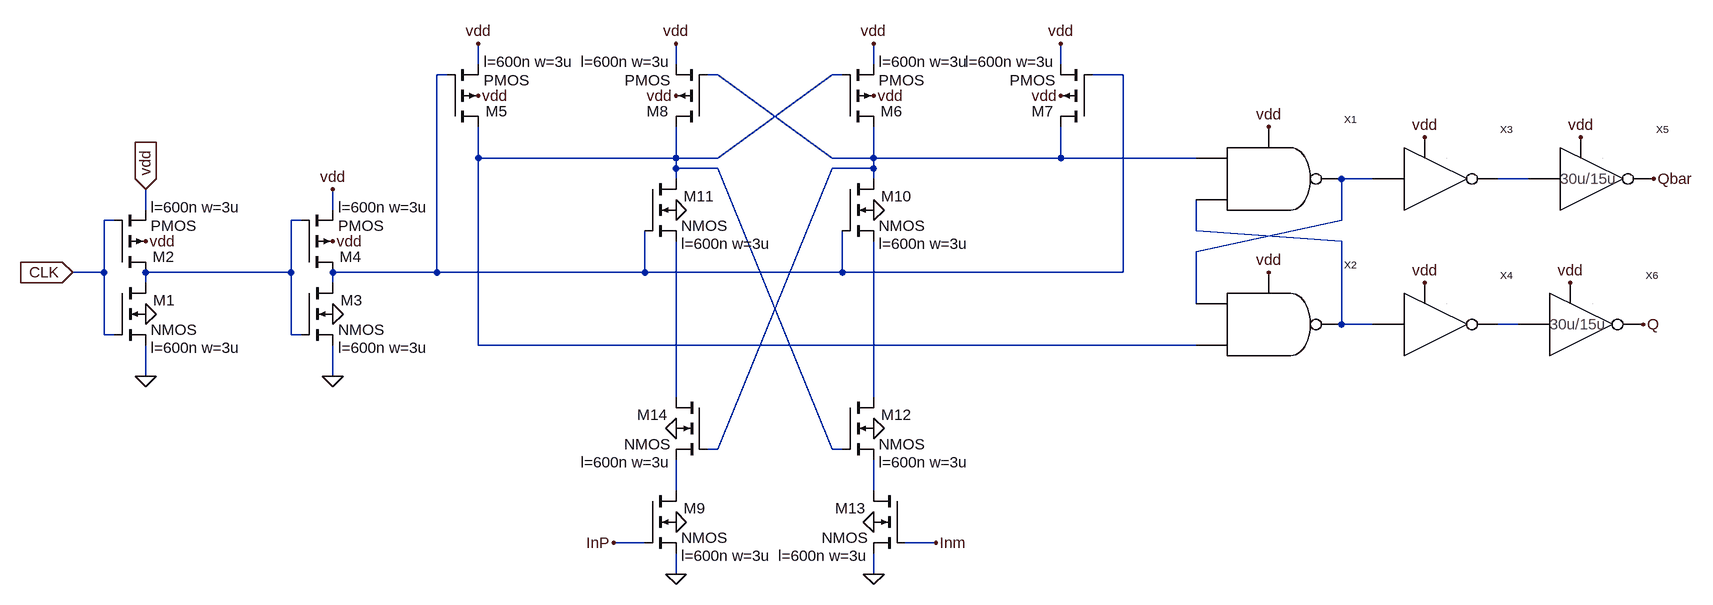
[diagram p0: schematic clk_comparator.asc]
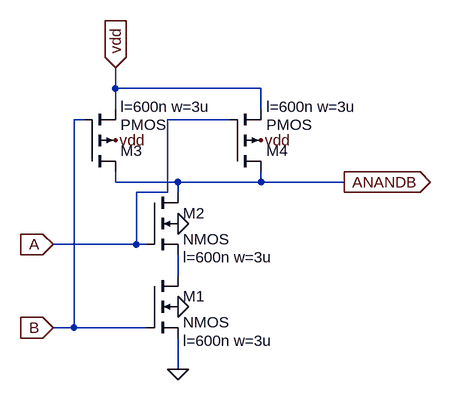
[diagram p1: sub-circuit nand_2.asc]
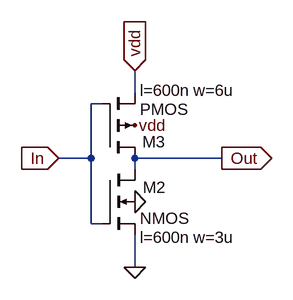
[diagram p2: sub-circuit inv_6u_3u.asc]
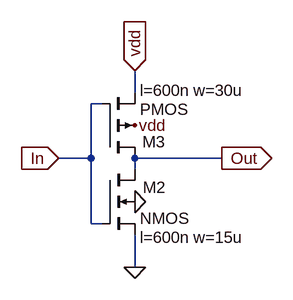
[diagram p3: sub-circuit inv_30u_15u.asc]
clk_comparator.asc, the LTspice schematic file:
Version 4
SHEET 1 2480 680
WIRE 592 -416 592 -448
WIRE 896 -416 896 -448
WIRE 1200 -416 1200 -448
WIRE 1488 -416 1488 -448
WIRE 544 -400 528 -400
WIRE 960 -400 944 -400
WIRE 1152 -400 1136 -400
WIRE 1584 -400 1536 -400
WIRE 592 -272 592 -320
WIRE 896 -272 896 -320
WIRE 896 -272 592 -272
WIRE 960 -272 1136 -400
WIRE 960 -272 896 -272
WIRE 1136 -272 960 -400
WIRE 1200 -272 1200 -320
WIRE 1200 -272 1136 -272
WIRE 1488 -272 1488 -320
WIRE 1488 -272 1200 -272
WIRE 1696 -272 1488 -272
WIRE 896 -256 896 -272
WIRE 960 -256 896 -256
WIRE 1200 -256 1200 -272
WIRE 1200 -256 1136 -256
WIRE 896 -240 896 -256
WIRE 1200 -240 1200 -256
WIRE 1968 -240 1920 -240
WIRE 2208 -240 2160 -240
WIRE 80 -192 80 -224
WIRE 368 -192 368 -224
WIRE 32 -176 16 -176
WIRE 320 -176 304 -176
WIRE 1920 -176 1920 -240
WIRE 1696 -160 1696 -208
WIRE 1920 -144 1696 -160
WIRE 1696 -128 1920 -176
WIRE 16 -96 16 -176
WIRE 16 -96 -32 -96
WIRE 304 -96 304 -176
WIRE 304 -96 80 -96
WIRE 528 -96 528 -400
WIRE 528 -96 368 -96
WIRE 848 -96 848 -160
WIRE 848 -96 528 -96
WIRE 1152 -96 1152 -160
WIRE 1152 -96 848 -96
WIRE 1584 -96 1584 -400
WIRE 1584 -96 1152 -96
WIRE 80 -80 80 -96
WIRE 368 -80 368 -96
WIRE 1696 -48 1696 -128
WIRE 1920 -16 1920 -144
WIRE 1968 -16 1920 -16
WIRE 2192 -16 2160 -16
WIRE 16 0 16 -96
WIRE 32 0 16 0
WIRE 304 0 304 -96
WIRE 320 0 304 0
WIRE 592 16 592 -272
WIRE 1696 16 592 16
WIRE 80 64 80 16
WIRE 368 64 368 16
WIRE 896 96 896 -144
WIRE 1200 96 1200 -144
WIRE 960 176 1136 -256
WIRE 960 176 944 176
WIRE 1136 176 960 -256
WIRE 1152 176 1136 176
WIRE 896 240 896 192
WIRE 1200 240 1200 192
WIRE 848 320 800 320
WIRE 1296 320 1248 320
WIRE 896 368 896 336
WIRE 1200 368 1200 336
FLAG 80 64 0
FLAG 80 -32 0
FLAG -32 -96 CLK
IOPIN -32 -96 In
FLAG 80 -224 vdd
IOPIN 80 -224 In
FLAG 80 -144 vdd
FLAG 368 64 0
FLAG 368 -32 0
FLAG 368 -224 vdd
FLAG 368 -144 vdd
FLAG 592 -448 vdd
FLAG 592 -368 vdd
FLAG 1200 -448 vdd
FLAG 1200 -368 vdd
FLAG 1488 -448 vdd
FLAG 1488 -368 vdd
FLAG 896 -448 vdd
FLAG 896 -368 vdd
FLAG 896 288 0
FLAG 1200 -192 0
FLAG 896 -192 0
FLAG 1200 144 0
FLAG 896 368 0
FLAG 800 320 InP
FLAG 1200 288 0
FLAG 1200 368 0
FLAG 1296 320 Inm
FLAG 896 144 0
FLAG 1808 -320 vdd
FLAG 1808 -96 vdd
FLAG 2048 -304 vdd
FLAG 2048 -80 vdd
FLAG 2272 -80 vdd
FLAG 2288 -304 vdd
FLAG 2400 -240 Qbar
FLAG 2384 -16 Q
SYMBOL nmos4 32 -80 R0
WINDOW 123 56 100 Left 2
WINDOW 0 60 27 Left 2
SYMATTR Value2 l=600n w=3u
SYMATTR InstName M1
SYMBOL pmos4 32 -96 M180
WINDOW 123 56 100 Left 2
WINDOW 0 59 24 Left 2
SYMATTR Value2 l=600n w=3u
SYMATTR InstName M2
SYMBOL nmos4 320 -80 R0
WINDOW 123 56 100 Left 2
WINDOW 0 60 27 Left 2
SYMATTR Value2 l=600n w=3u
SYMATTR InstName M3
SYMBOL pmos4 320 -96 M180
WINDOW 123 56 100 Left 2
WINDOW 0 59 24 Left 2
SYMATTR Value2 l=600n w=3u
SYMATTR InstName M4
SYMBOL pmos4 544 -320 M180
WINDOW 123 56 100 Left 2
WINDOW 0 59 24 Left 2
SYMATTR Value2 l=600n w=3u
SYMATTR InstName M5
SYMBOL pmos4 1152 -320 M180
WINDOW 123 56 100 Left 2
WINDOW 0 59 24 Left 2
SYMATTR Value2 l=600n w=3u
SYMATTR InstName M6
SYMBOL pmos4 1536 -320 R180
WINDOW 123 56 100 Left 2
WINDOW 0 59 24 Left 2
SYMATTR Value2 l=600n w=3u
SYMATTR InstName M7
SYMBOL pmos4 944 -320 R180
WINDOW 123 56 100 Left 2
WINDOW 0 59 24 Left 2
SYMATTR Value2 l=600n w=3u
SYMATTR InstName M8
SYMBOL nmos4 848 240 R0
WINDOW 123 56 100 Left 2
WINDOW 0 60 27 Left 2
SYMATTR Value2 l=600n w=3u
SYMATTR InstName M9
SYMBOL nmos4 1152 -240 R0
WINDOW 123 56 100 Left 2
WINDOW 0 60 27 Left 2
SYMATTR Value2 l=600n w=3u
SYMATTR InstName M10
SYMBOL nmos4 848 -240 R0
WINDOW 123 56 100 Left 2
WINDOW 0 60 27 Left 2
SYMATTR Value2 l=600n w=3u
SYMATTR InstName M11
SYMBOL nmos4 1152 96 R0
WINDOW 123 56 100 Left 2
WINDOW 0 60 27 Left 2
SYMATTR Value2 l=600n w=3u
SYMATTR InstName M12
SYMBOL nmos4 1248 240 M0
WINDOW 123 56 100 Left 2
WINDOW 0 60 27 Left 2
SYMATTR Value2 l=600n w=3u
SYMATTR InstName M13
SYMBOL nmos4 944 96 M0
WINDOW 123 56 100 Left 2
WINDOW 0 60 27 Left 2
SYMATTR Value2 l=600n w=3u
SYMATTR InstName M14
SYMBOL NAND_2 1728 -240 R0
SYMATTR InstName X1
SYMBOL NAND_2 1728 -16 R0
SYMATTR InstName X2
SYMBOL Inv_6u_3u 1968 -240 R0
SYMATTR InstName X3
SYMBOL Inv_6u_3u 1968 -16 R0
SYMATTR InstName X4
SYMBOL Inv_30u_15u 2208 -240 R0
SYMATTR InstName X5
SYMBOL Inv_30u_15u 2192 -16 R0
SYMATTR InstName X6

nand_2.asc, the sub-circuit schematic file:
Version 4
SHEET 1 880 680
WIRE 176 -96 176 -128
WIRE 400 -96 176 -96
WIRE 176 -64 176 -96
WIRE 400 -64 400 -96
WIRE 128 -48 112 -48
WIRE 352 -48 256 -48
WIRE 176 48 176 32
WIRE 272 48 176 48
WIRE 400 48 400 32
WIRE 400 48 272 48
WIRE 528 48 400 48
WIRE 256 64 256 -48
WIRE 256 64 208 64
WIRE 272 64 272 48
WIRE 208 144 208 64
WIRE 208 144 80 144
WIRE 224 144 208 144
WIRE 272 192 272 160
WIRE 112 272 112 -48
WIRE 112 272 80 272
WIRE 224 272 112 272
WIRE 272 336 272 288
FLAG 272 336 0
FLAG 272 240 0
FLAG 272 112 0
FLAG 80 144 A
IOPIN 80 144 In
FLAG 80 272 B
IOPIN 80 272 In
FLAG 176 -128 vdd
IOPIN 176 -128 In
FLAG 176 -16 vdd
FLAG 400 -16 vdd
FLAG 528 48 ANANDB
IOPIN 528 48 Out
SYMBOL nmos4 224 192 R0
WINDOW 123 56 100 Left 2
SYMATTR InstName M1
SYMATTR Value2 l=600n w=3u
SYMBOL nmos4 224 64 R0
WINDOW 123 56 100 Left 2
SYMATTR InstName M2
SYMATTR Value2 l=600n w=3u
SYMBOL pmos4 128 32 M180
WINDOW 123 56 100 Left 2
SYMATTR InstName M3
SYMATTR Value2 l=600n w=3u
SYMBOL pmos4 352 32 M180
WINDOW 123 56 100 Left 2
SYMATTR InstName M4
SYMATTR Value2 l=600n w=3u

inv_6u_3u.asc, the sub-circuit schematic file:
Version 4
SHEET 1 880 680
WIRE 272 -48 272 -80
WIRE 224 -32 208 -32
WIRE 208 48 208 -32
WIRE 208 48 160 48
WIRE 400 48 272 48
WIRE 272 64 272 48
WIRE 208 144 208 48
WIRE 224 144 208 144
WIRE 272 208 272 160
FLAG 272 208 0
FLAG 272 112 0
FLAG 160 48 In
IOPIN 160 48 In
FLAG 272 -80 vdd
IOPIN 272 -80 In
FLAG 272 0 vdd
FLAG 400 48 Out
IOPIN 400 48 Out
SYMBOL nmos4 224 64 R0
WINDOW 123 56 100 Left 2
WINDOW 0 60 27 Left 2
SYMATTR Value2 l=600n w=3u
SYMATTR InstName M2
SYMBOL pmos4 224 48 M180
WINDOW 123 56 100 Left 2
WINDOW 0 59 24 Left 2
SYMATTR Value2 l=600n w=6u
SYMATTR InstName M3

inv_30u_15u.asc, the sub-circuit schematic file:
Version 4
SHEET 1 880 680
WIRE 272 -48 272 -80
WIRE 224 -32 208 -32
WIRE 208 48 208 -32
WIRE 208 48 160 48
WIRE 400 48 272 48
WIRE 272 64 272 48
WIRE 208 144 208 48
WIRE 224 144 208 144
WIRE 272 208 272 160
FLAG 272 208 0
FLAG 272 112 0
FLAG 160 48 In
IOPIN 160 48 In
FLAG 272 -80 vdd
IOPIN 272 -80 In
FLAG 272 0 vdd
FLAG 400 48 Out
IOPIN 400 48 Out
SYMBOL nmos4 224 64 R0
WINDOW 123 56 100 Left 2
WINDOW 0 60 27 Left 2
SYMATTR Value2 l=600n w=15u
SYMATTR InstName M2
SYMBOL pmos4 224 48 M180
WINDOW 123 56 100 Left 2
WINDOW 0 59 24 Left 2
SYMATTR Value2 l=600n w=30u
SYMATTR InstName M3

The netlist it stands for:
* clk_comparator.asc
M1 N006 CLK 0 0 NMOS l=600n w=3u
M2 N006 CLK vdd vdd PMOS l=600n w=3u
M3 N001 N006 0 0 NMOS l=600n w=3u
M4 N001 N006 vdd vdd PMOS l=600n w=3u
M5 N003 N001 vdd vdd PMOS l=600n w=3u
M6 N002 N003 vdd vdd PMOS l=600n w=3u
M7 N002 N001 vdd vdd PMOS l=600n w=3u
M8 N003 N002 vdd vdd PMOS l=600n w=3u
M9 N011 InP 0 0 NMOS l=600n w=3u
M10 N002 N001 N010 0 NMOS l=600n w=3u
M11 N003 N001 N009 0 NMOS l=600n w=3u
M12 N010 N003 N012 0 NMOS l=600n w=3u
M13 N012 Inm 0 0 NMOS l=600n w=3u
M14 N009 N002 N011 0 NMOS l=600n w=3u
XX1 N002 N007 N004 vdd nand_2
XX2 N004 N003 N007 vdd nand_2
XX3 N004 N005 vdd inv_6u_3u
XX4 N007 N008 vdd inv_6u_3u
XX5 N005 Qbar vdd inv_30u_15u
XX6 N008 Q vdd inv_30u_15u

* block symbol definitions
.subckt nand_2 A B ANANDB vdd
M1 N001 B 0 0 NMOS l=600n w=3u
M2 ANANDB A N001 0 NMOS l=600n w=3u
M3 ANANDB B vdd vdd PMOS l=600n w=3u
M4 ANANDB A vdd vdd PMOS l=600n w=3u
.ends nand_2

.subckt inv_6u_3u In Out vdd
M2 Out In 0 0 NMOS l=600n w=3u
M3 Out In vdd vdd PMOS l=600n w=6u
.ends inv_6u_3u

.subckt inv_30u_15u In Out vdd
M2 Out In 0 0 NMOS l=600n w=15u
M3 Out In vdd vdd PMOS l=600n w=30u
.ends inv_30u_15u

.model NMOS NMOS
.model PMOS PMOS
.lib standard.mos
.backanno
.end